# Altium schematic sheet Communication.SchDoc
size A4
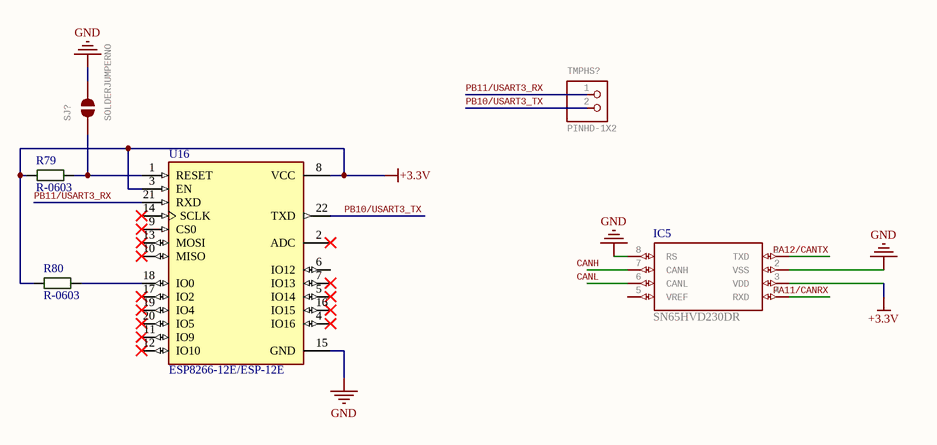
[diagram p0: Communication.SchDoc]

## Parts
IC5  SN65HVD230DR  [SO08]
R79  R-0603  [R-0603R]
R80  R-0603  [R-0603R]
SJ?  SOLDERJUMPERNO  [SJ_2S-NO]
TMPHS?  PINHD-1X2  [1X02]
U16  ESP8266-12E/ESP-12E  [XCVR_ESP8266-12E/ESP-12E]

## Nets
+3.3V: IC5.3(VDD) R79.1 R80.1 U16.3(EN) U16.8(VCC)
GND: IC5.2(VSS) IC5.8(RS) SJ?.2 U16.15(GND)
CANH: IC5.7(CANH)
CANL: IC5.6(CANL)
PA11/CANRX: IC5.4(RXD)
PA12/CANTX: IC5.1(TXD)
PB10/USART3_TX: TMPHS?.2 U16.22(TXD)
PB11/USART3_RX: TMPHS?.1 U16.21(RXD)
NetR79_2: R79.2 SJ?.1 U16.1(RESET)
NetR80_2: R80.2 U16.18(IO0)

Not connected (* = marked no-connect by the designer): IC5 5(VREF); U16 2(ADC)* 4(IO16)* 5(IO14)* 6(IO12) 7(IO13)* 9(CS0)* 10(MISO)* 11(IO9)* 12(IO10)* 13(MOSI)* 14(SCLK)* 16(IO15)* 17(IO2)* 19(IO4)* 20(IO5)*

## Library data of the parts
IC5 = MCP2551: CAN transceiver; GateName_1: G$1; SymbolName_1: MCP2551; LibraryName: SparkFun-DigitalIC; DeviceSetName: MCP2551
SJ? = SOLDERJUMPERNO: Solder JumperStandard SMD solder jumper. Used to automate production. Two varients : Normally Open and Normally Closed are the same, but have different paste layers. NC will have a large amount of paste and should jumper during reflow.; GateName_1: 1; SymbolName_1: SJ; DeviceName: NO; LibraryName: SparkFun-Passives; DeviceSetName: SOLDERJUMPER
TMPHS? = PINHD-1X2: PIN HEADER; GateName_1: G$1; SymbolName_1: PINHD2; LibraryName: pinhead; DeviceSetName: PINHD-1X2
U16 = ESP8266-12E/ESP-12E: This WiFi module has a 32-bit MCU micro and clock speeds supporting 80 MHz or 160 MHz. Supports the RTOS and integrated Wi-Fi MAC/BB/RF/PA/LNA, and has an on-board antenna.; MF: AI-Thinker; Price: None; Package: None; Value: *; MP: ESP8266-12E/ESP-12E; Availability: Unavailable; SnapEDA_Link: https://www.snapeda.com/parts/ESP8266-12E/ESP-12E/AI-Thinker/view-part/106414/?ref=snap